# EAGLE schematic stepper-v1 (EAGLE 6.4)
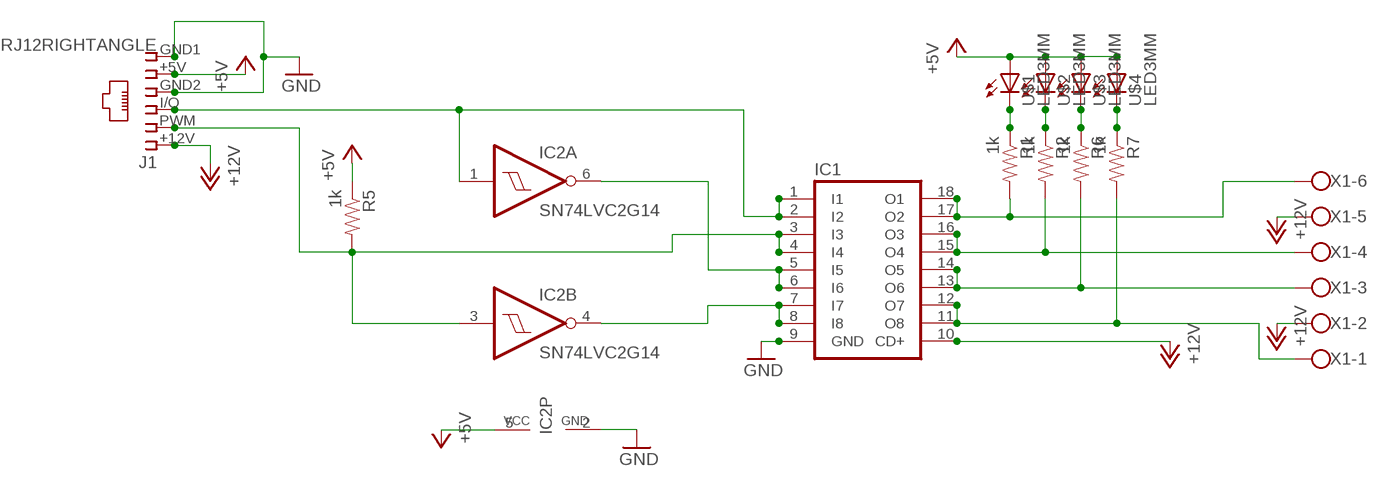
[diagram p0: schematic, sheet 1]

## Parts
IC1  ULN2803A  [SO18W]
IC2  SN74LVC2G14  [SOT23-6]
J1  RJ12RIGHTANGLE  [RJ12-RIGHTANGLE]
R1  1k  RESISTOR1206  [1206]
R2  1k  RESISTOR1206  [1206]
R5  1k  RESISTOR1206  [1206]
R6  1k  RESISTOR1206  [1206]
R7  1k  RESISTOR1206  [1206]
U$1  LED3MM  [LED3MM]
U$2  LED3MM  [LED3MM]
U$3  LED3MM  [LED3MM]
U$4  LED3MM  [LED3MM]
X1  W237-6  [W237-6]

## Nets
+5V [power]: IC2.5(P:VCC) J1.+5V R5.1 U$1.A U$2.A U$3.A U$4.A
+12V [power]: IC1.10(CD+) J1.+12V X1.2 X1.5
GND [power]: IC1.9(GND) IC2.2(P:GND) J1.GND1 J1.GND2
N$1: IC1.1(I1) IC1.2(I2) IC2.1(A:I) J1.I/O
N$2: IC1.3(I3) IC1.4(I4) IC2.3(B:I) J1.PWM R5.2
N$3 [power]: IC1.17(O2) IC1.18(O1) R1.2 X1.6
N$4 [power]: IC1.15(O4) IC1.16(O3) R2.2 X1.4
N$5 [power]: IC1.13(O6) IC1.14(O5) R6.2 X1.3
N$6 [power]: IC1.11(O8) IC1.12(O7) R7.2 X1.1
N$7: IC1.7(I7) IC1.8(I8) IC2.4(B:O)
N$9: R1.1 U$1.K(C)
N$10: R2.1 U$2.K(C)
N$11: R6.1 U$3.K(C)
N$12: R7.1 U$4.K(C)
N$14: IC1.5(I5) IC1.6(I6) IC2.6(A:O)

## Library data of the parts
IC1 = lpatiny:ULN2803A: DRIVER ARRAY
IC2 = lpatiny:SN74LVC2G14: Dual schmitt trigger INVERTER
J1 = lpatiny:RJ12: CORCOM Modular RJ Jacks No Shield Source: www.tycoelectronics.com .. ENG_DS_1654001_1099_RJ_L_0507.pdf
R1 R2 R5-R7 = SparkFun:RESISTOR: Resistor Basic schematic elements and footprints for 0603, 1206, and PTH resistors.
U$1-U$4 = lpatiny:LED3MM
X1 = con-wago-500:W237-6: WAGO SCREW CLAMP; OC_FARNELL: unknown; OC_NEWARK: unknown

## Net classes
0 default: width 0.305 mm
1 power: width 0.762 mm